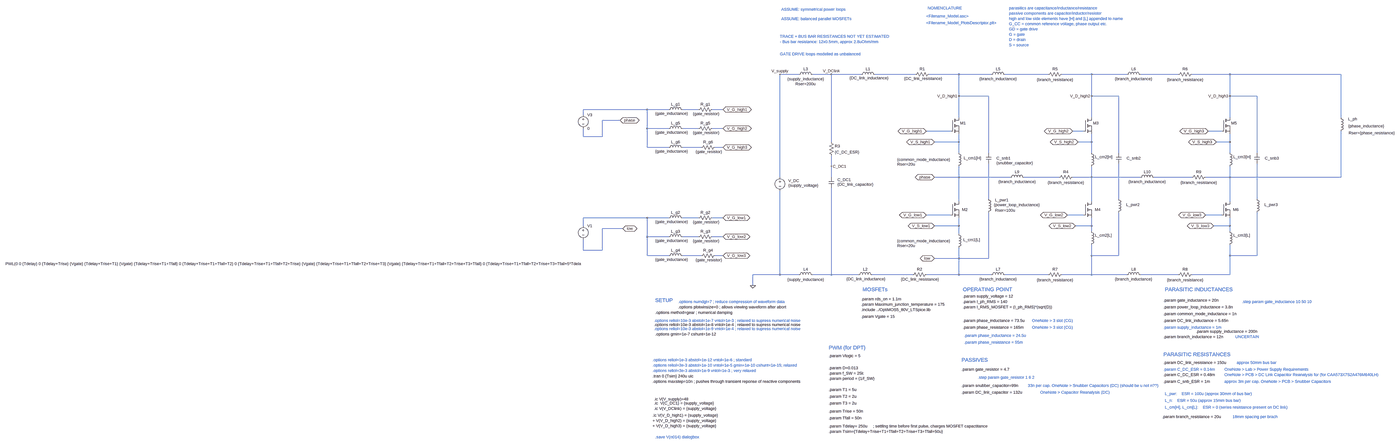
[diagram p0: schematic InverterUnbalancedDPT_12V_522DPT.asc, whole sheet]
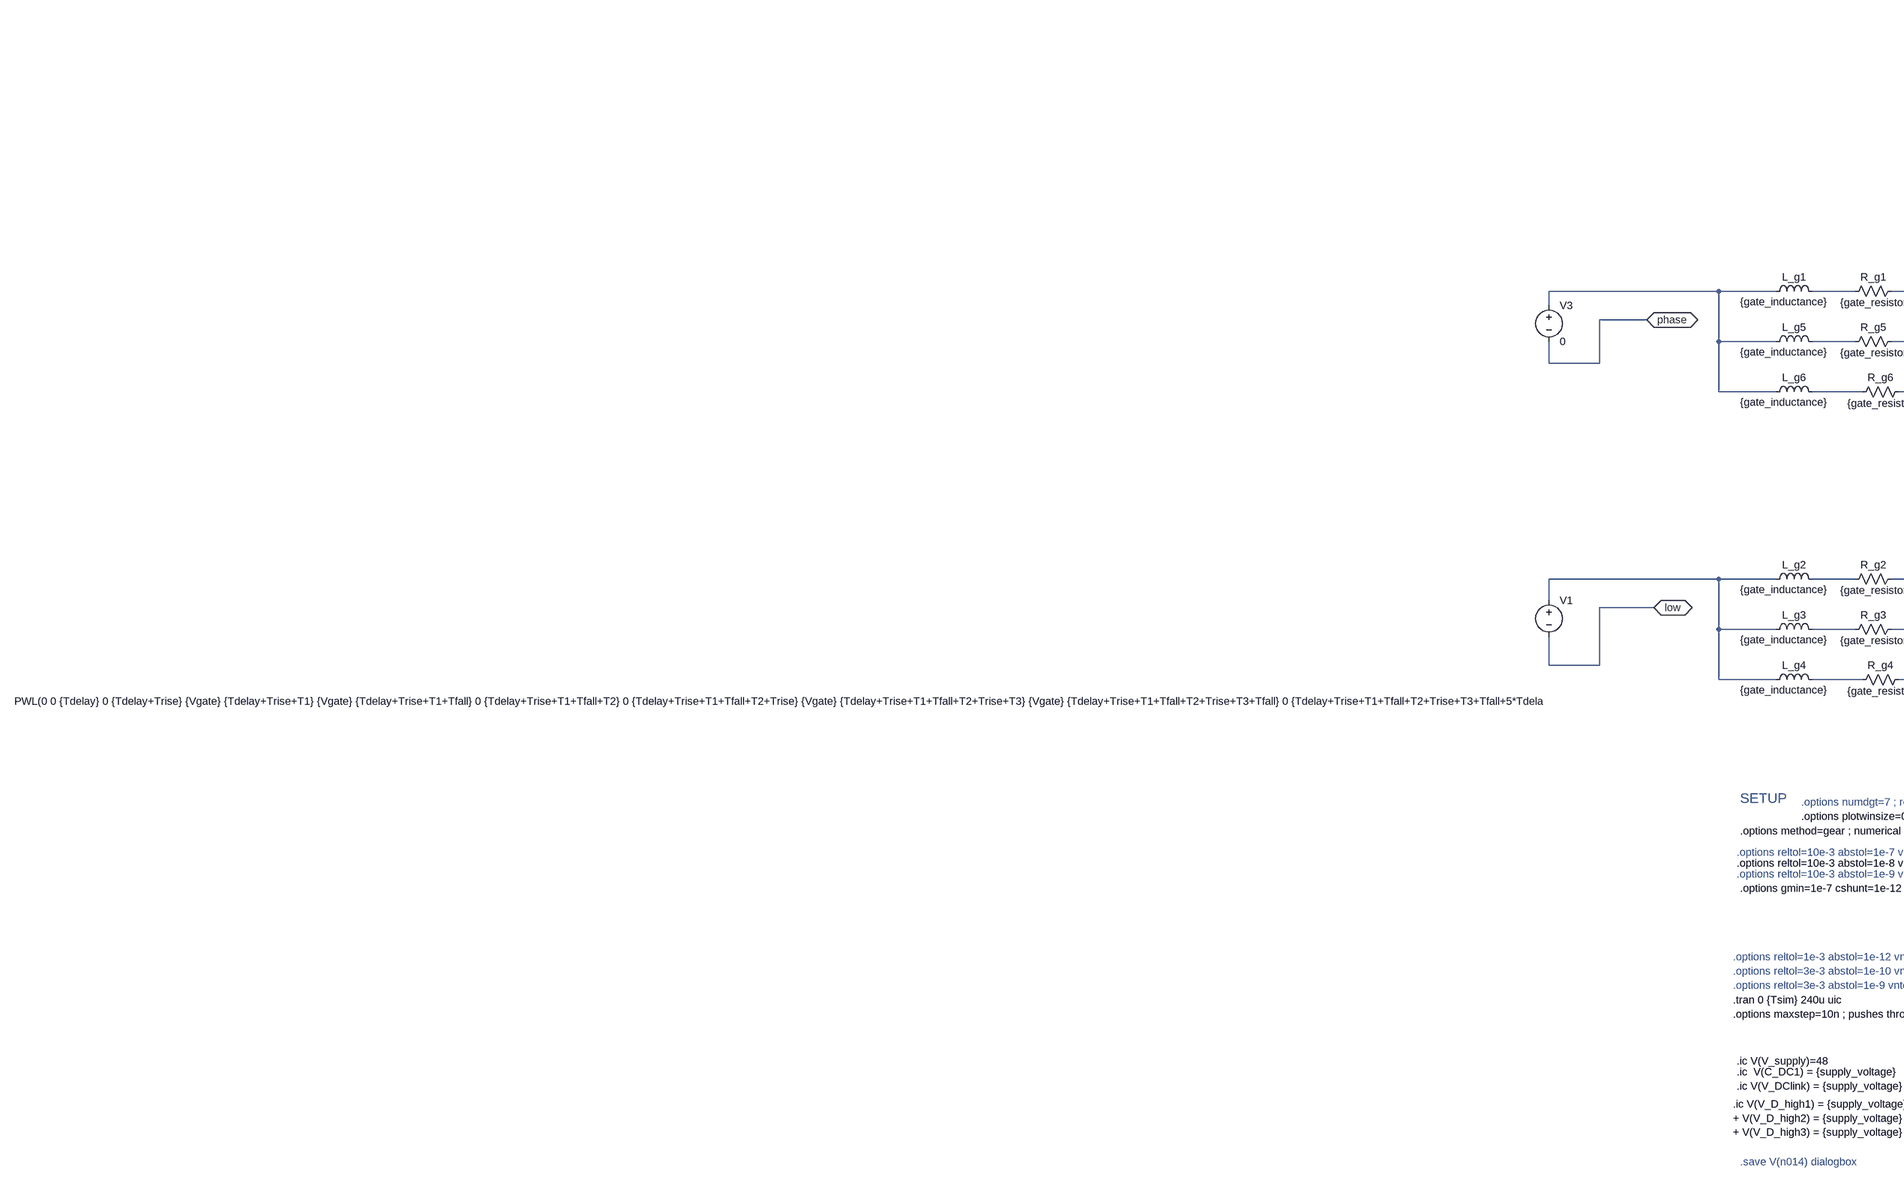
[diagram p1: schematic InverterUnbalancedDPT_12V_522DPT.asc, part, row 1 of 1, column 1 of 2]
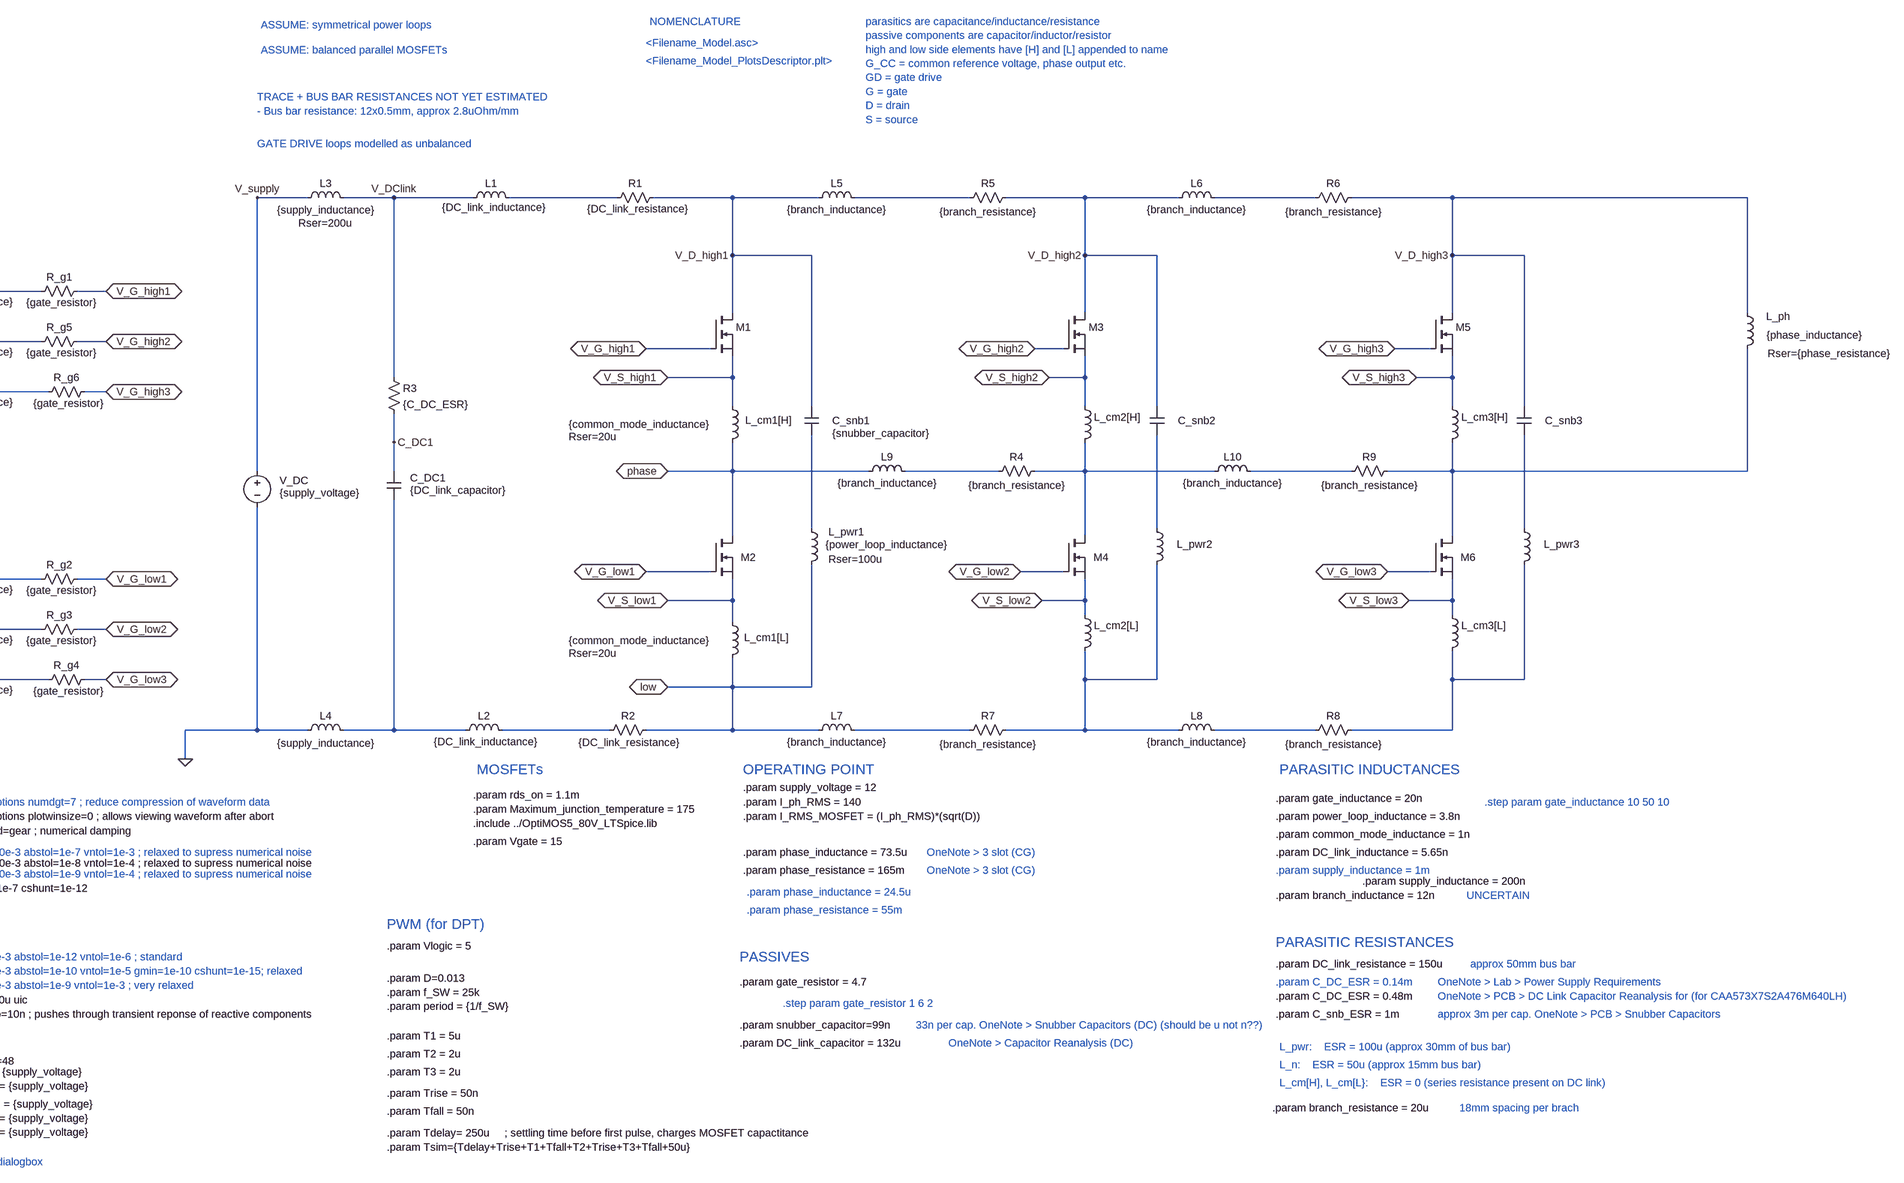
[diagram p2: schematic InverterUnbalancedDPT_12V_522DPT.asc, part, row 1 of 1, column 2 of 2]
InverterUnbalancedDPT_12V_522DPT.asc, the LTspice schematic file:
Version 4.1
SHEET 1 7948 3392
WIRE 1136 -928 1024 -928
WIRE 1328 -928 1216 -928
WIRE 1504 -928 1328 -928
WIRE 1824 -928 1584 -928
WIRE 2080 -928 1904 -928
WIRE 2272 -928 2080 -928
WIRE 2608 -928 2352 -928
WIRE 2864 -928 2688 -928
WIRE 3072 -928 2864 -928
WIRE 3376 -928 3152 -928
WIRE 3680 -928 3456 -928
WIRE 4336 -928 3680 -928
WIRE 2080 -800 2080 -928
WIRE 2256 -800 2080 -800
WIRE 2864 -800 2864 -928
WIRE 3024 -800 2864 -800
WIRE 3680 -800 3680 -928
WIRE 3840 -800 3680 -800
WIRE 240 -720 -352 -720
WIRE 368 -720 240 -720
WIRE 544 -720 448 -720
WIRE 688 -720 624 -720
WIRE -352 -688 -352 -720
WIRE 2080 -672 2080 -800
WIRE 2864 -672 2864 -800
WIRE 3680 -672 3680 -800
WIRE 4336 -672 4336 -928
WIRE 80 -656 -240 -656
WIRE 240 -608 240 -720
WIRE 368 -608 240 -608
WIRE 544 -608 448 -608
WIRE 688 -608 624 -608
WIRE 2032 -592 1888 -592
WIRE 2080 -592 2080 -608
WIRE 2816 -592 2752 -592
WIRE 2864 -592 2864 -608
WIRE 3632 -592 3552 -592
WIRE 3680 -592 3680 -608
WIRE -352 -560 -352 -608
WIRE -240 -560 -240 -656
WIRE -240 -560 -352 -560
WIRE 1328 -528 1328 -928
WIRE 2080 -528 2080 -576
WIRE 2080 -528 1936 -528
WIRE 2864 -528 2864 -576
WIRE 2864 -528 2784 -528
WIRE 3680 -528 3680 -576
WIRE 3680 -528 3600 -528
WIRE 240 -496 240 -608
WIRE 368 -496 240 -496
WIRE 560 -496 448 -496
WIRE 688 -496 640 -496
WIRE 2080 -464 2080 -528
WIRE 2256 -464 2256 -800
WIRE 2864 -464 2864 -528
WIRE 3024 -464 3024 -800
WIRE 3680 -464 3680 -528
WIRE 3840 -464 3840 -800
WIRE 1328 -384 1328 -448
WIRE 1024 -320 1024 -928
WIRE 1328 -320 1328 -384
WIRE 2080 -320 2080 -384
WIRE 2080 -320 1936 -320
WIRE 2384 -320 2080 -320
WIRE 2672 -320 2464 -320
WIRE 2864 -320 2864 -384
WIRE 2864 -320 2752 -320
WIRE 3152 -320 2864 -320
WIRE 3456 -320 3232 -320
WIRE 3680 -320 3680 -384
WIRE 3680 -320 3536 -320
WIRE 4336 -320 4336 -592
WIRE 4336 -320 3680 -320
WIRE 2256 -192 2256 -400
WIRE 3024 -192 3024 -400
WIRE 3840 -192 3840 -400
WIRE 2080 -176 2080 -320
WIRE 2864 -176 2864 -320
WIRE 3680 -176 3680 -320
WIRE 2032 -96 1888 -96
WIRE 2816 -96 2720 -96
WIRE 3632 -96 3536 -96
WIRE 240 -80 -352 -80
WIRE 368 -80 240 -80
WIRE 544 -80 448 -80
WIRE 688 -80 624 -80
WIRE -352 -32 -352 -80
WIRE 2080 -32 2080 -80
WIRE 2080 -32 1936 -32
WIRE 2864 -32 2864 -80
WIRE 2864 -32 2768 -32
WIRE 3680 -32 3680 -80
WIRE 3680 -32 3584 -32
WIRE 96 -16 -240 -16
WIRE 2864 0 2864 -32
WIRE 3680 0 3680 -32
WIRE 2080 16 2080 -32
WIRE 240 32 240 -80
WIRE 368 32 240 32
WIRE 544 32 448 32
WIRE 688 32 624 32
WIRE -352 112 -352 48
WIRE -240 112 -240 -16
WIRE -240 112 -352 112
WIRE 240 144 240 32
WIRE 368 144 240 144
WIRE 560 144 448 144
WIRE 688 144 640 144
WIRE 2864 144 2864 80
WIRE 3024 144 3024 -112
WIRE 3024 144 2864 144
WIRE 3680 144 3680 80
WIRE 3840 144 3840 -112
WIRE 3840 144 3680 144
WIRE 2080 160 2080 96
WIRE 2080 160 1936 160
WIRE 2256 160 2256 -112
WIRE 2256 160 2080 160
WIRE 1024 256 1024 -240
WIRE 1024 256 864 256
WIRE 1136 256 1024 256
WIRE 1328 256 1328 -256
WIRE 1328 256 1216 256
WIRE 1488 256 1328 256
WIRE 1808 256 1568 256
WIRE 2080 256 2080 160
WIRE 2080 256 1888 256
WIRE 2272 256 2080 256
WIRE 2608 256 2352 256
WIRE 2864 256 2864 144
WIRE 2864 256 2688 256
WIRE 3072 256 2864 256
WIRE 3376 256 3152 256
WIRE 3680 256 3680 144
WIRE 3680 256 3456 256
WIRE 864 320 864 256
FLAG 688 -80 V_G_low1
IOPIN 688 -80 BiDir
FLAG 1888 -592 V_G_high1
IOPIN 1888 -592 BiDir
FLAG 1888 -96 V_G_low1
IOPIN 1888 -96 BiDir
FLAG 864 320 0
FLAG 1936 -320 phase
IOPIN 1936 -320 BiDir
FLAG 2080 -800 V_D_high1
FLAG 1328 -928 V_DClink
FLAG 2752 -592 V_G_high2
IOPIN 2752 -592 BiDir
FLAG 1936 -32 V_S_low1
IOPIN 1936 -32 BiDir
FLAG 2720 -96 V_G_low2
IOPIN 2720 -96 BiDir
FLAG 3536 -96 V_G_low3
IOPIN 3536 -96 BiDir
FLAG 3552 -592 V_G_high3
IOPIN 3552 -592 BiDir
FLAG 2784 -528 V_S_high2
IOPIN 2784 -528 BiDir
FLAG 3600 -528 V_S_high3
IOPIN 3600 -528 BiDir
FLAG 2768 -32 V_S_low2
IOPIN 2768 -32 BiDir
FLAG 3584 -32 V_S_low3
IOPIN 3584 -32 BiDir
FLAG 1328 -384 C_DC1
FLAG 1936 -528 V_S_high1
IOPIN 1936 -528 BiDir
FLAG 1024 -928 V_supply
FLAG 2864 -800 V_D_high2
FLAG 3680 -800 V_D_high3
FLAG 1936 160 low
IOPIN 1936 160 BiDir
FLAG 688 32 V_G_low2
IOPIN 688 32 BiDir
FLAG 688 144 V_G_low3
IOPIN 688 144 BiDir
FLAG 80 -656 phase
IOPIN 80 -656 BiDir
FLAG 688 -720 V_G_high1
IOPIN 688 -720 BiDir
FLAG 688 -608 V_G_high2
IOPIN 688 -608 BiDir
FLAG 688 -496 V_G_high3
IOPIN 688 -496 BiDir
FLAG 96 -16 low
IOPIN 96 -16 BiDir
SYMBOL voltage 1024 -336 R0
WINDOW 3 50 65 Left 2
WINDOW 0 50 37 Left 2
SYMATTR Value {supply_voltage}
SYMATTR InstName V_DC
SYMATTR SpiceLine Rser=0
SYMBOL cap 1312 -320 R0
WINDOW 0 52 15 Left 2
WINDOW 3 52 43 Left 2
SYMATTR InstName C_DC1
SYMATTR Value {DC_link_capacitor}
SYMATTR SpiceLine Rser=0
SYMBOL cap 2240 -464 R0
WINDOW 0 62 32 Left 2
WINDOW 3 62 60 Left 2
SYMATTR InstName C_snb1
SYMATTR Value {snubber_capacitor}
SYMATTR SpiceLine Rser=0
SYMBOL ind 4320 -688 R0
WINDOW 0 58 24 Left 2
WINDOW 3 59 66 Left 2
WINDOW 39 61 107 Left 2
SYMATTR InstName L_ph
SYMATTR Value {phase_inductance}
SYMATTR SpiceLine Rser={phase_resistance}
SYMBOL nmos 2032 -672 R0
WINDOW 3 56 72 Invisible 2
SYMATTR Value IPTG011N08NM5_L0
SYMATTR InstName M1
SYMATTR Prefix X
SYMBOL nmos 2032 -176 R0
WINDOW 0 67 48 Left 2
WINDOW 3 56 72 Invisible 2
SYMATTR InstName M2
SYMATTR Value IPTG011N08NM5_L0
SYMATTR Prefix X
SYMBOL ind 2064 -480 R0
WINDOW 3 -348 56 Left 2
WINDOW 0 45 47 Left 2
WINDOW 39 -348 84 Left 2
SYMATTR Value {common_mode_inductance}
SYMATTR InstName L_cm1[H]
SYMATTR SpiceLine Rser=20u
SYMBOL ind 2064 0 R0
WINDOW 3 -348 57 Left 2
WINDOW 0 42 50 Left 2
WINDOW 39 -348 85 Left 2
SYMATTR Value {common_mode_inductance}
SYMATTR InstName L_cm1[L]
SYMATTR SpiceLine Rser=20u
SYMBOL ind 2240 -208 R0
WINDOW 0 54 23 Left 2
WINDOW 3 47 52 Left 2
WINDOW 39 54 84 Left 2
SYMATTR InstName L_pwr1
SYMATTR Value {power_loop_inductance}
SYMATTR SpiceLine Rser=100u
SYMBOL cap 3008 -464 R0
WINDOW 0 62 32 Left 2
WINDOW 3 24 56 Invisible 2
SYMATTR InstName C_snb2
SYMATTR Value {snubber_capacitor}
SYMBOL nmos 2816 -672 R0
WINDOW 3 56 72 Invisible 2
SYMATTR Value IPTG011N08NM5_L0
SYMATTR InstName M3
SYMATTR Prefix X
SYMBOL nmos 2816 -176 R0
WINDOW 0 67 48 Left 2
WINDOW 3 56 72 Invisible 2
SYMATTR InstName M4
SYMATTR Value IPTG011N08NM5_L0
SYMATTR Prefix X
SYMBOL ind 2848 -480 R0
WINDOW 3 36 80 Invisible 2
SYMATTR Value {common_mode_inductance}
SYMATTR InstName L_cm2[H]
SYMATTR SpiceLine Rser=20u
SYMBOL ind 2848 -16 R0
WINDOW 3 36 80 Invisible 2
SYMATTR Value {common_mode_inductance}
SYMATTR InstName L_cm2[L]
SYMATTR SpiceLine Rser=20u
SYMBOL ind 3008 -208 R0
WINDOW 0 60 51 Left 2
WINDOW 3 36 80 Invisible 2
SYMATTR InstName L_pwr2
SYMATTR Value {power_loop_inductance}
SYMATTR SpiceLine Rser=100u
SYMBOL cap 3824 -464 R0
WINDOW 0 62 32 Left 2
WINDOW 3 24 56 Invisible 2
SYMATTR InstName C_snb3
SYMATTR Value {snubber_capacitor}
SYMBOL nmos 3632 -672 R0
WINDOW 3 56 72 Invisible 2
SYMATTR Value IPTG011N08NM5_L0
SYMATTR InstName M5
SYMATTR Prefix X
SYMBOL nmos 3632 -176 R0
WINDOW 0 67 48 Left 2
WINDOW 3 56 72 Invisible 2
SYMATTR InstName M6
SYMATTR Value IPTG011N08NM5_L0
SYMATTR Prefix X
SYMBOL ind 3664 -480 R0
WINDOW 3 36 80 Invisible 2
SYMATTR Value {common_mode_inductance}
SYMATTR InstName L_cm3[H]
SYMATTR SpiceLine Rser=20u
SYMBOL ind 3664 -16 R0
WINDOW 3 36 80 Invisible 2
SYMATTR Value {common_mode_inductance}
SYMATTR InstName L_cm3[L]
SYMATTR SpiceLine Rser=20u
SYMBOL ind 3824 -208 R0
WINDOW 0 60 51 Left 2
WINDOW 3 36 80 Invisible 2
SYMATTR InstName L_pwr3
SYMATTR Value {power_loop_inductance}
SYMATTR SpiceLine Rser=100u
SYMBOL ind 1488 -912 R270
WINDOW 0 32 56 VTop 2
WINDOW 3 -21 62 VTop 2
SYMATTR InstName L1
SYMATTR Value {DC_link_inductance}
SYMATTR SpiceLine Rser=0
SYMBOL ind 1472 272 R270
WINDOW 0 32 56 VTop 2
WINDOW 3 -26 60 VTop 2
SYMATTR InstName L2
SYMATTR Value {DC_link_inductance}
SYMATTR SpiceLine Rser=0
SYMBOL res 1920 -944 R90
WINDOW 0 0 56 VBottom 2
WINDOW 3 57 51 VBottom 2
SYMATTR InstName R1
SYMATTR Value {DC_link_resistance}
SYMBOL res 1904 240 R90
WINDOW 0 0 56 VBottom 2
WINDOW 3 59 54 VBottom 2
SYMATTR InstName R2
SYMATTR Value {DC_link_resistance}
SYMBOL ind 1120 -912 R270
WINDOW 0 32 56 VTop 2
WINDOW 3 -27 56 VTop 2
WINDOW 39 -56 55 VTop 2
SYMATTR InstName L3
SYMATTR Value {supply_inductance}
SYMATTR SpiceLine Rser=200u
SYMBOL ind 1120 272 R270
WINDOW 0 32 56 VTop 2
WINDOW 3 -29 56 VTop 2
SYMATTR InstName L4
SYMATTR Value {supply_inductance}
SYMATTR SpiceLine Rser=200u
SYMBOL res 1312 -544 R0
SYMATTR InstName R3
SYMATTR Value {C_DC_ESR}
SYMBOL voltage -352 -48 R0
WINDOW 123 0 0 Left 0
WINDOW 39 0 0 Left 0
WINDOW 3 -3411 240 Left 2
SYMATTR Value PWL(0 0 {Tdelay} 0 {Tdelay+Trise} {Vgate} {Tdelay+Trise+T1} {Vgate} {Tdelay+Trise+T1+Tfall} 0 {Tdelay+Trise+T1+Tfall+T2} 0 {Tdelay+Trise+T1+Tfall+T2+Trise} {Vgate} {Tdelay+Trise+T1+Tfall+T2+Trise+T3} {Vgate} {Tdelay+Trise+T1+Tfall+T2+Trise+T3+Tfall} 0 {Tdelay+Trise+T1+Tfall+T2+Trise+T3+Tfall+5*Tdelay} 0)
SYMATTR InstName V1
SYMBOL ind 2256 -912 R270
WINDOW 0 32 56 VTop 2
WINDOW 3 5 56 VBottom 2
SYMATTR InstName L5
SYMATTR Value {branch_inductance}
SYMATTR SpiceLine Rser=0
SYMBOL res 2704 -944 R90
WINDOW 0 0 56 VBottom 2
WINDOW 3 32 56 VTop 2
SYMATTR InstName R5
SYMATTR Value {branch_resistance}
SYMBOL ind 3056 -912 R270
WINDOW 0 32 56 VTop 2
WINDOW 3 5 56 VBottom 2
SYMATTR InstName L6
SYMATTR Value {branch_inductance}
SYMATTR SpiceLine Rser=0
SYMBOL res 3472 -944 R90
WINDOW 0 0 56 VBottom 2
WINDOW 3 32 56 VTop 2
SYMATTR InstName R6
SYMATTR Value {branch_resistance}
SYMBOL ind 2256 272 R270
WINDOW 0 32 56 VTop 2
WINDOW 3 5 56 VBottom 2
SYMATTR InstName L7
SYMATTR Value {branch_inductance}
SYMATTR SpiceLine Rser=0
SYMBOL res 2704 240 R90
WINDOW 0 0 56 VBottom 2
WINDOW 3 32 56 VTop 2
SYMATTR InstName R7
SYMATTR Value {branch_resistance}
SYMBOL ind 3056 272 R270
WINDOW 0 32 56 VTop 2
WINDOW 3 5 56 VBottom 2
SYMATTR InstName L8
SYMATTR Value {branch_inductance}
SYMATTR SpiceLine Rser=0
SYMBOL res 3472 240 R90
WINDOW 0 0 56 VBottom 2
WINDOW 3 32 56 VTop 2
SYMATTR InstName R8
SYMATTR Value {branch_resistance}
SYMBOL ind 352 -64 R270
WINDOW 0 32 56 VTop 2
WINDOW 3 -23 33 VTop 2
SYMATTR InstName L_g2
SYMATTR Value {gate_inductance}
SYMATTR SpiceLine Rser=0
SYMBOL res 528 -64 R270
WINDOW 0 32 56 VTop 2
WINDOW 3 -25 61 VTop 2
SYMATTR InstName R_g2
SYMATTR Value {gate_resistor}
SYMBOL ind 352 48 R270
WINDOW 0 32 56 VTop 2
WINDOW 3 -23 33 VTop 2
SYMATTR InstName L_g3
SYMATTR Value {gate_inductance}
SYMATTR SpiceLine Rser=0
SYMBOL ind 352 160 R270
WINDOW 0 32 56 VTop 2
WINDOW 3 -23 33 VTop 2
SYMATTR InstName L_g4
SYMATTR Value {gate_inductance}
SYMATTR SpiceLine Rser=0
SYMBOL res 528 48 R270
WINDOW 0 32 56 VTop 2
WINDOW 3 -25 61 VTop 2
SYMATTR InstName R_g3
SYMATTR Value {gate_resistor}
SYMBOL res 544 160 R270
WINDOW 0 32 56 VTop 2
WINDOW 3 -25 61 VTop 2
SYMATTR InstName R_g4
SYMATTR Value {gate_resistor}
SYMBOL voltage -352 -704 R0
WINDOW 123 0 0 Left 0
WINDOW 39 0 0 Left 0
SYMATTR InstName V3
SYMATTR Value 0
SYMBOL ind 352 -704 R270
WINDOW 0 32 56 VTop 2
WINDOW 3 -23 33 VTop 2
SYMATTR InstName L_g1
SYMATTR Value {gate_inductance}
SYMATTR SpiceLine Rser=0
SYMBOL res 528 -704 R270
WINDOW 0 32 56 VTop 2
WINDOW 3 -25 61 VTop 2
SYMATTR InstName R_g1
SYMATTR Value {gate_resistor}
SYMBOL ind 352 -592 R270
WINDOW 0 32 56 VTop 2
WINDOW 3 -23 33 VTop 2
SYMATTR InstName L_g5
SYMATTR Value {gate_inductance}
SYMATTR SpiceLine Rser=0
SYMBOL ind 352 -480 R270
WINDOW 0 32 56 VTop 2
WINDOW 3 -23 33 VTop 2
SYMATTR InstName L_g6
SYMATTR Value {gate_inductance}
SYMATTR SpiceLine Rser=0
SYMBOL res 528 -592 R270
WINDOW 0 32 56 VTop 2
WINDOW 3 -25 61 VTop 2
SYMATTR InstName R_g5
SYMATTR Value {gate_resistor}
SYMBOL res 544 -480 R270
WINDOW 0 32 56 VTop 2
WINDOW 3 -25 61 VTop 2
SYMATTR InstName R_g6
SYMATTR Value {gate_resistor}
SYMBOL ind 2368 -304 R270
WINDOW 0 32 56 VTop 2
WINDOW 3 5 56 VBottom 2
SYMATTR InstName L9
SYMATTR Value {branch_inductance}
SYMATTR SpiceLine Rser=0
SYMBOL res 2768 -336 R90
WINDOW 0 0 56 VBottom 2
WINDOW 3 32 56 VTop 2
SYMATTR InstName R4
SYMATTR Value {branch_resistance}
SYMBOL ind 3136 -304 R270
WINDOW 0 32 56 VTop 2
WINDOW 3 5 56 VBottom 2
SYMATTR InstName L10
SYMATTR Value {branch_inductance}
SYMATTR SpiceLine Rser=0
SYMBOL res 3552 -336 R90
WINDOW 0 0 56 VBottom 2
WINDOW 3 32 56 VTop 2
SYMATTR InstName R9
SYMATTR Value {branch_resistance}
TEXT 1312 808 Left 2 !.param D=0.013\n.param f_SW = 25k\n.param period = {1/f_SW}
TEXT 272 760 Left 2 ;.options reltol=1e-3 abstol=1e-12 vntol=1e-6 ; standard
TEXT 1504 464 Left 2 !.include ../OptiMOS5_80V_LTSpice.lib
TEXT 2096 912 Left 2 !.param snubber_capacitor=99n
TEXT 2096 952 Left 2 !.param DC_link_capacitor = 132u
TEXT 2104 384 Left 2 !.param supply_voltage = 12
TEXT 2104 568 Left 2 !.param phase_resistance = 165m
TEXT 2104 528 Left 2 !.param phase_inductance = 73.5u
TEXT 2104 416 Left 2 !.param I_ph_RMS = 140
TEXT 2104 448 Left 2 !.param I_RMS_MOSFET = (I_ph_RMS)*(sqrt(D))
TEXT 1504 432 Left 2 !.param Maximum_junction_temperature = 175
TEXT 1504 400 Left 2 !.param rds_on = 1.1m
TEXT 3288 488 Left 2 !.param common_mode_inductance = 1n
TEXT 3288 448 Left 2 !.param power_loop_inductance = 3.8n
TEXT 2096 816 Left 2 !.param gate_resistor = 4.7
TEXT 3288 408 Left 2 !.param gate_inductance = 20n
TEXT 288 408 Left 3 ;SETUP
TEXT 1512 344 Left 3 ;MOSFETs
TEXT 2104 344 Left 3 ;OPERATING POINT
TEXT 3296 344 Left 3 ;PARASITIC INDUCTANCES
TEXT 2096 760 Left 3 ;PASSIVES
TEXT 1504 504 Left 2 !.param Vgate = 15
TEXT 2192 864 Left 2 ;.step param gate_resistor 1 6 2
TEXT 3288 528 Left 2 !.param DC_link_inductance = 5.65n
TEXT 1032 -1312 Left 2 ;ASSUME: symmetrical power loops
TEXT 1024 -1152 Left 2 ;TRACE + BUS BAR RESISTANCES NOT YET ESTIMATED\n- Bus bar resistance: 12x0.5mm, approx 2.8uOhm/mm
TEXT 1032 -1256 Left 2 ;ASSUME: balanced parallel MOSFETs
TEXT 1024 -1048 Left 2 ;GATE DRIVE loops modelled as unbalanced
TEXT 3288 568 Left 2 ;.param supply_inductance = 1m
TEXT 3288 728 Left 3 ;PARASITIC RESISTANCES
TEXT 3288 776 Left 2 !.param DC_link_resistance = 150u
TEXT 3288 816 Left 2 ;.param C_DC_ESR = 0.14m
TEXT 2560 952 Left 2 ;OneNote > Capacitor Reanalysis (DC)
TEXT 2488 912 Left 2 ;33n per cap. OneNote > Snubber Capacitors (DC) (should be u not n??)
TEXT 2512 528 Left 2 ;OneNote > 3 slot (CG)
TEXT 2512 568 Left 2 ;OneNote > 3 slot (CG)
TEXT 424 448 Left 2 !.options plotwinsize=0 ; allows viewing waveform after abort
TEXT 2376 -1320 Left 2 ;parasitics are capacitance/inductance/resistance\npassive components are capacitor/inductor/resistor\nhigh and low side elements have [H] and [L] appended to name\nG_CC = common reference voltage, phase output etc.\nGD = gate drive\nG = gate\nD = drain\nS = source
TEXT 272 888 Left 2 !.options maxstep=10n ; pushes through transient reponse of reactive components
TEXT 272 824 Left 2 ;.options reltol=3e-3 abstol=1e-9 vntol=1e-3 ; very relaxed
TEXT 280 576 Left 2 ;.options reltol=10e-3 abstol=1e-9 vntol=1e-4 ; relaxed to supress numerical noise
TEXT 1312 688 Left 3 ;PWM (for DPT)
TEXT 3296 960 Left 2 ;L_pwr:    ESR = 100u (approx 30mm of bus bar)
TEXT 3296 1040 Left 2 ;L_cm[H], L_cm[L}:    ESR = 0 (series resistance present on DC link)
TEXT 3296 1000 Left 2 ;L_n:    ESR = 50u (approx 15mm bus bar)
TEXT 3648 816 Left 2 ;OneNote > Lab > Power Supply Requirements
TEXT 3288 888 Left 2 !.param C_snb_ESR = 1m
TEXT 3288 848 Left 2 !.param C_DC_ESR = 0.48m
TEXT 3648 848 Left 2 ;OneNote > PCB > DC Link Capacitor Reanalysis for (for CAA573X7S2A476M640LH)
TEXT 3720 776 Left 2 ;approx 50mm bus bar
TEXT 3648 888 Left 2 ;approx 3m per cap. OneNote > PCB > Snubber Capacitors
TEXT 1312 936 Left 2 !.param T1 = 5u
TEXT 1312 976 Left 2 !.param T2 = 2u
TEXT 1312 1016 Left 2 !.param T3 = 2u
TEXT 1312 1064 Left 2 !.param Trise = 50n
TEXT 1312 1104 Left 2 !.param Tfall = 50n
TEXT 1312 1184 Left 2 !.param Tsim={Tdelay+Trise+T1+Tfall+T2+Trise+T3+Tfall+50u}
TEXT 272 856 Left 2 !.tran 0 {Tsim} 240u uic
TEXT 1312 1152 Left 2 !.param Tdelay= 250u     ; settling time before first pulse, charges MOSFET capactitance
TEXT 280 1016 Left 2 !.ic  V(C_DC1) = {supply_voltage}
TEXT 3752 416 Left 2 ;.step param gate_inductance 10 50 10
TEXT 288 480 Left 2 !.options method=gear ; numerical damping
TEXT 272 792 Left 2 ;.options reltol=3e-3 abstol=1e-10 vntol=1e-5 gmin=1e-10 cshunt=1e-15; relaxed
TEXT 424 416 Left 2 ;.options numdgt=7 ; reduce compression of waveform data
TEXT 272 1088 Left 2 !.ic V(V_D_high1) = {supply_voltage}\n+ V(V_D_high2) = {supply_voltage}\n+ V(V_D_high3) = {supply_voltage}
TEXT 288 1216 Left 2 ;.save V(n014) dialogbox
TEXT 280 1048 Left 2 !.ic V(V_DClink) = {supply_voltage}
TEXT 1896 -1320 Left 2 ;NOMENCLATURE
TEXT 1888 -1272 Left 2 ;<Filename_Model.asc>
TEXT 1888 -1232 Left 2 ;<Filename_Model_PlotsDescriptor.plt>
TEXT 288 608 Left 2 !.options gmin=1e-7 cshunt=1e-12
TEXT 280 992 Left 2 !.ic V(V_supply)=48
TEXT 3288 624 Left 2 !.param branch_inductance = 12n
TEXT 3280 1096 Left 2 !.param branch_resistance = 20u
TEXT 280 552 Left 2 !.options reltol=10e-3 abstol=1e-8 vntol=1e-4 ; relaxed to supress numerical noise
TEXT 1312 736 Left 2 !.param Vlogic = 5
TEXT 3696 1096 Left 2 ;18mm spacing per brach
TEXT 3712 624 Left 2 ;UNCERTAIN
TEXT 280 528 Left 2 ;.options reltol=10e-3 abstol=1e-7 vntol=1e-3 ; relaxed to supress numerical noise
TEXT 2112 616 Left 2 ;.param phase_inductance = 24.5u
TEXT 2112 656 Left 2 ;.param phase_resistance = 55m
TEXT 3480 592 Left 2 !.param supply_inductance = 200n

The netlist it stands for:
* InverterUnbalancedDPT_12V_522DPT.asc
V_DC V_supply 0 {supply_voltage} Rser=0
C_DC1 C_DC1 N024 {DC_link_capacitor} Rser=0
C_snb1 V_D_high1 N015 {snubber_capacitor} Rser=0
L_ph V_D_high3 N014 {phase_inductance} Rser={phase_resistance}
X§M1 V_D_high1 V_G_high1 V_S_high1 IPTG011N08NM5_L0  ; pins D G S
X§M2 phase V_G_low1 V_S_low1 IPTG011N08NM5_L0  ; pins D G S
L_cm1[H] V_S_high1 phase {common_mode_inductance} Rser=20u
L_cm1[L] V_S_low1 low {common_mode_inductance} Rser=20u
L_pwr1 N015 low {power_loop_inductance} Rser=100u
C_snb2 V_D_high2 N016 {snubber_capacitor}
X§M3 V_D_high2 V_G_high2 V_S_high2 IPTG011N08NM5_L0  ; pins D G S
X§M4 N012 V_G_low2 V_S_low2 IPTG011N08NM5_L0  ; pins D G S
L_cm2[H] V_S_high2 N012 {common_mode_inductance} Rser=20u
L_cm2[L] V_S_low2 N022 {common_mode_inductance} Rser=20u
L_pwr2 N016 N022 {power_loop_inductance} Rser=100u
C_snb3 V_D_high3 N017 {snubber_capacitor}
X§M5 V_D_high3 V_G_high3 V_S_high3 IPTG011N08NM5_L0  ; pins D G S
X§M6 N014 V_G_low3 V_S_low3 IPTG011N08NM5_L0  ; pins D G S
L_cm3[H] V_S_high3 N014 {common_mode_inductance} Rser=20u
L_cm3[L] V_S_low3 N023 {common_mode_inductance} Rser=20u
L_pwr3 N017 N023 {power_loop_inductance} Rser=100u
L1 V_DClink N001 {DC_link_inductance} Rser=0
L2 N024 N025 {DC_link_inductance} Rser=0
R1 V_D_high1 N001 {DC_link_resistance}
R2 low N025 {DC_link_resistance}
L3 V_supply V_DClink {supply_inductance} Rser=200u
L4 0 N024 {supply_inductance} Rser=200u
R3 V_DClink C_DC1 {C_DC_ESR}
V1 N018 low PWL(0 0 {Tdelay} 0 {Tdelay+Trise} {Vgate} {Tdelay+Trise+T1} {Vgate} {Tdelay+Trise+T1+Tfall} 0 {Tdelay+Trise+T1+Tfall+T2} 0 {Tdelay+Trise+T1+Tfall+T2+Trise} {Vgate} {Tdelay+Trise+T1+Tfall+T2+Trise+T3} {Vgate} {Tdelay+Trise+T1+Tfall+T2+Trise+T3+Tfall} 0 {Tdelay+Trise+T1+Tfall+T2+Trise+T3+Tfall+5*Tdelay} 0)
L5 V_D_high1 N002 {branch_inductance} Rser=0
R5 V_D_high2 N002 {branch_resistance}
L6 V_D_high2 N003 {branch_inductance} Rser=0
R6 V_D_high3 N003 {branch_resistance}
L7 low N026 {branch_inductance} Rser=0
R7 N022 N026 {branch_resistance}
L8 N022 N027 {branch_inductance} Rser=0
R8 N023 N027 {branch_resistance}
L_g2 N018 N019 {gate_inductance} Rser=0
R_g2 N019 V_G_low1 {gate_resistor}
L_g3 N018 N020 {gate_inductance} Rser=0
L_g4 N018 N021 {gate_inductance} Rser=0
R_g3 N020 V_G_low2 {gate_resistor}
R_g4 N021 V_G_low3 {gate_resistor}
V3 N004 phase 0
L_g1 N004 N005 {gate_inductance} Rser=0
R_g1 N005 V_G_high1 {gate_resistor}
L_g5 N004 N006 {gate_inductance} Rser=0
L_g6 N004 N010 {gate_inductance} Rser=0
R_g5 N006 V_G_high2 {gate_resistor}
R_g6 N010 V_G_high3 {gate_resistor}
L9 phase N011 {branch_inductance} Rser=0
R4 N012 N011 {branch_resistance}
L10 N012 N013 {branch_inductance} Rser=0
R9 N014 N013 {branch_resistance}
.param D=0.013
.param f_SW = 25k
.param period = {1/f_SW}
* .options reltol=1e-3 abstol=1e-12 vntol=1e-6 ; standard
.include ../OptiMOS5_80V_LTSpice.lib
.param snubber_capacitor=99n
.param DC_link_capacitor = 132u
.param supply_voltage = 12
.param phase_resistance = 165m
.param phase_inductance = 73.5u
.param I_ph_RMS = 140
.param I_RMS_MOSFET = (I_ph_RMS)*(sqrt(D))
.param Maximum_junction_temperature = 175
.param rds_on = 1.1m
.param common_mode_inductance = 1n
.param power_loop_inductance = 3.8n
.param gate_resistor = 4.7
.param gate_inductance = 20n
* SETUP
* MOSFETs
* OPERATING POINT
* PARASITIC INDUCTANCES
* PASSIVES
.param Vgate = 15
* .step param gate_resistor 1 6 2
.param DC_link_inductance = 5.65n
* ASSUME: symmetrical power loops
* TRACE + BUS BAR RESISTANCES NOT YET ESTIMATED
* - Bus bar resistance: 12x0.5mm, approx 2.8uOhm/mm
* ASSUME: balanced parallel MOSFETs
* GATE DRIVE loops modelled as unbalanced
* .param supply_inductance = 1m
* PARASITIC RESISTANCES
.param DC_link_resistance = 150u
* .param C_DC_ESR = 0.14m
* OneNote > Capacitor Reanalysis (DC)
* 33n per cap. OneNote > Snubber Capacitors (DC) (should be u not n??)
* OneNote > 3 slot (CG)
* OneNote > 3 slot (CG)
.options plotwinsize=0 ; allows viewing waveform after abort
* parasitics are capacitance/inductance/resistance
* passive components are capacitor/inductor/resistor
* high and low side elements have [H] and [L] appended to name
* G_CC = common reference voltage, phase output etc.
* GD = gate drive
* G = gate
* D = drain
* S = source
.options maxstep=10n ; pushes through transient reponse of reactive components
* .options reltol=3e-3 abstol=1e-9 vntol=1e-3 ; very relaxed
* .options reltol=10e-3 abstol=1e-9 vntol=1e-4 ; relaxed to supress numerical noise
* PWM (for DPT)
* L_pwr:    ESR = 100u (approx 30mm of bus bar)
* L_cm[H], L_cm[L}:    ESR = 0 (series resistance present on DC link)
* L_n:    ESR = 50u (approx 15mm bus bar)
* OneNote > Lab > Power Supply Requirements
.param C_snb_ESR = 1m
.param C_DC_ESR = 0.48m
* OneNote > PCB > DC Link Capacitor Reanalysis for (for CAA573X7S2A476M640LH)
* approx 50mm bus bar
* approx 3m per cap. OneNote > PCB > Snubber Capacitors
.param T1 = 5u
.param T2 = 2u
.param T3 = 2u
.param Trise = 50n
.param Tfall = 50n
.param Tsim={Tdelay+Trise+T1+Tfall+T2+Trise+T3+Tfall+50u}
.tran 0 {Tsim} 240u uic
.param Tdelay= 250u     ; settling time before first pulse, charges MOSFET capactitance
.ic  V(C_DC1) = {supply_voltage}
* .step param gate_inductance 10 50 10
.options method=gear ; numerical damping
* .options reltol=3e-3 abstol=1e-10 vntol=1e-5 gmin=1e-10 cshunt=1e-15; relaxed
* .options numdgt=7 ; reduce compression of waveform data
.ic V(V_D_high1) = {supply_voltage}
+ V(V_D_high2) = {supply_voltage}
+ V(V_D_high3) = {supply_voltage}
* .save V(n014) dialogbox
.ic V(V_DClink) = {supply_voltage}
* NOMENCLATURE
* <Filename_Model.asc>
* <Filename_Model_PlotsDescriptor.plt>
.options gmin=1e-7 cshunt=1e-12
.ic V(V_supply)=48
.param branch_inductance = 12n
.param branch_resistance = 20u
.options reltol=10e-3 abstol=1e-8 vntol=1e-4 ; relaxed to supress numerical noise
.param Vlogic = 5
* 18mm spacing per brach
* UNCERTAIN
* .options reltol=10e-3 abstol=1e-7 vntol=1e-3 ; relaxed to supress numerical noise
* .param phase_inductance = 24.5u
* .param phase_resistance = 55m
.param supply_inductance = 200n
.backanno
.end